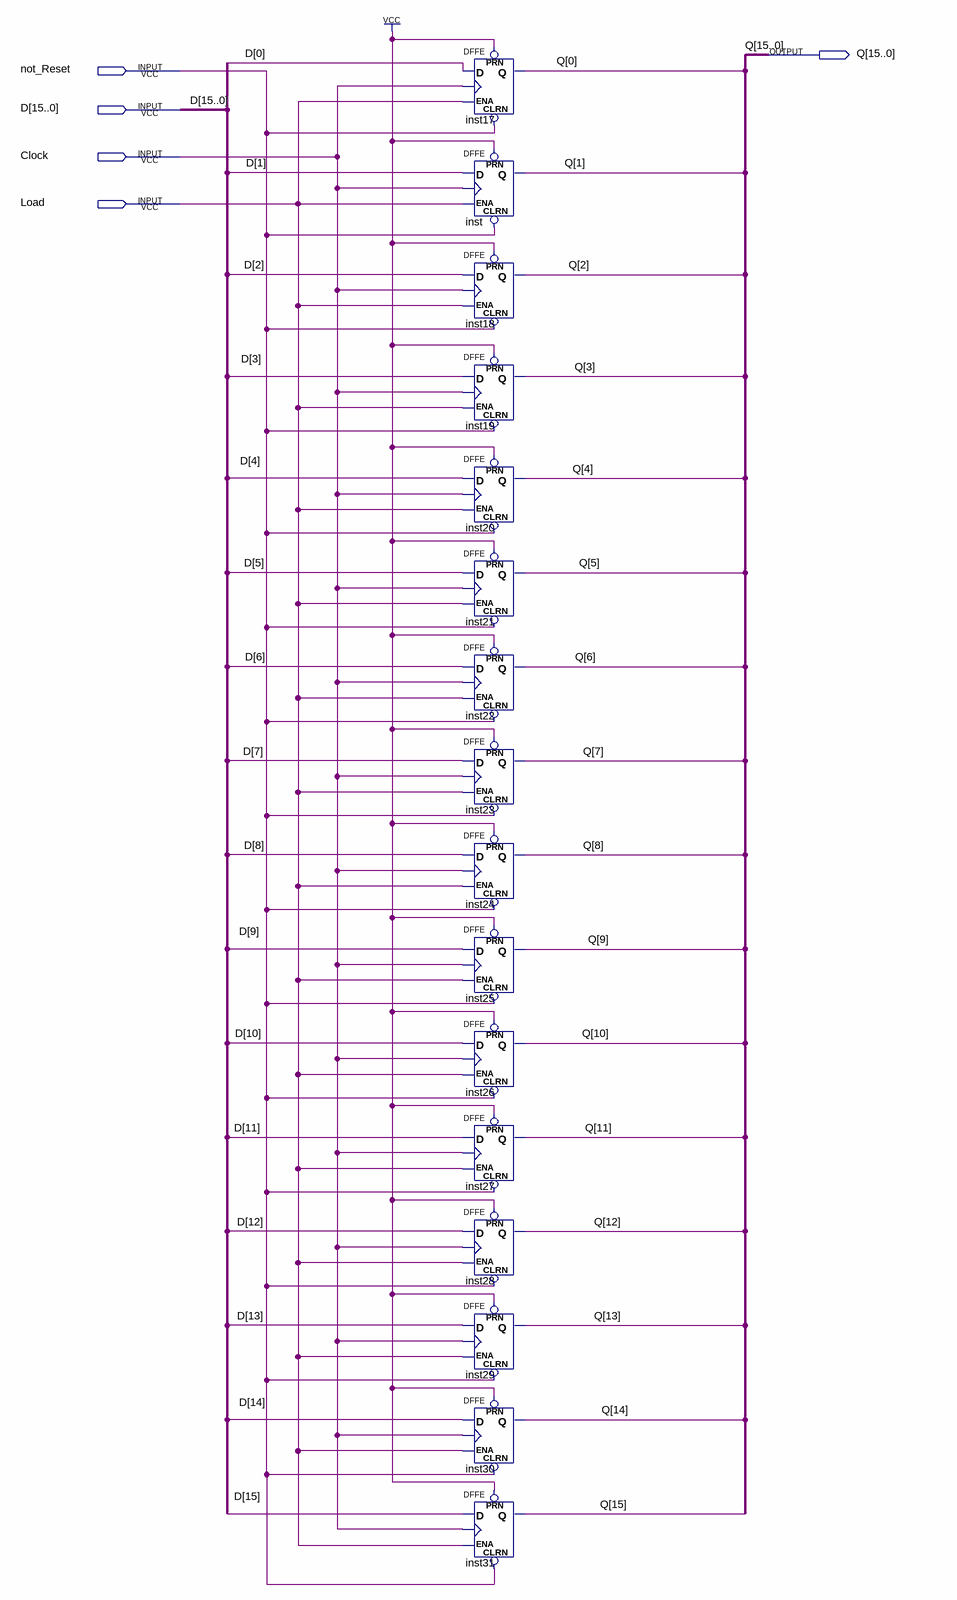
[diagram p0: schematic sheet]
// Quartus schematic 16_Bit_Register.bdf as structural Verilog: 16 symbols, 5 pins
module \16_Bit_Register  (
  input  not_Reset,
  input  [15:0] D,
  input  Clock,
  input  Load,
  output [15:0] Q
);

  DFFE inst17 (.PRN(1'b1), .CLRN(not_Reset), .D(D[0]), .CLK(Clock), .ENA(Load), .Q(Q[0]));
  DFFE inst (.PRN(1'b1), .CLRN(not_Reset), .D(D[1]), .CLK(Clock), .ENA(Load), .Q(Q[1]));
  DFFE inst18 (.PRN(1'b1), .CLRN(not_Reset), .D(D[2]), .CLK(Clock), .ENA(Load), .Q(Q[2]));
  DFFE inst19 (.PRN(1'b1), .CLRN(not_Reset), .D(D[3]), .CLK(Clock), .ENA(Load), .Q(Q[3]));
  DFFE inst20 (.PRN(1'b1), .CLRN(not_Reset), .D(D[4]), .CLK(Clock), .ENA(Load), .Q(Q[4]));
  DFFE inst21 (.PRN(1'b1), .CLRN(not_Reset), .D(D[5]), .CLK(Clock), .ENA(Load), .Q(Q[5]));
  DFFE inst22 (.PRN(1'b1), .CLRN(not_Reset), .D(D[6]), .CLK(Clock), .ENA(Load), .Q(Q[6]));
  DFFE inst23 (.PRN(1'b1), .CLRN(not_Reset), .D(D[7]), .CLK(Clock), .ENA(Load), .Q(Q[7]));
  DFFE inst24 (.PRN(1'b1), .CLRN(not_Reset), .D(D[8]), .CLK(Clock), .ENA(Load), .Q(Q[8]));
  DFFE inst25 (.PRN(1'b1), .CLRN(not_Reset), .D(D[9]), .CLK(Clock), .ENA(Load), .Q(Q[9]));
  DFFE inst26 (.PRN(1'b1), .CLRN(not_Reset), .D(D[10]), .CLK(Clock), .ENA(Load), .Q(Q[10]));
  DFFE inst27 (.PRN(1'b1), .CLRN(not_Reset), .D(D[11]), .CLK(Clock), .ENA(Load), .Q(Q[11]));
  DFFE inst28 (.PRN(1'b1), .CLRN(not_Reset), .D(D[12]), .CLK(Clock), .ENA(Load), .Q(Q[12]));
  DFFE inst29 (.PRN(1'b1), .CLRN(not_Reset), .D(D[13]), .CLK(Clock), .ENA(Load), .Q(Q[13]));
  DFFE inst30 (.PRN(1'b1), .CLRN(not_Reset), .D(D[14]), .CLK(Clock), .ENA(Load), .Q(Q[14]));
  DFFE inst31 (.PRN(1'b1), .CLRN(not_Reset), .D(D[15]), .CLK(Clock), .ENA(Load), .Q(Q[15]));
endmodule
